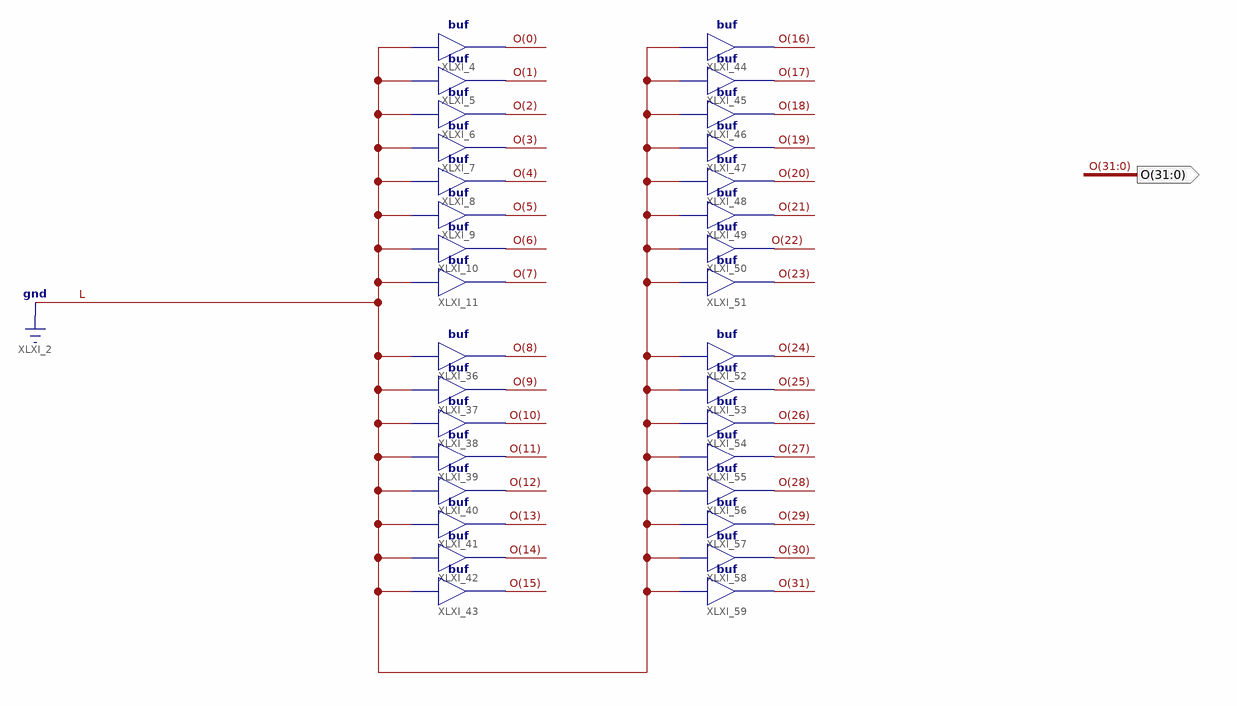
[diagram p0: schematic sheet 1]
// Xilinx ISE schematic DATA0_32.sch (spartan3e) as structural Verilog: 32 symbols, 1 ports
module DATA0_32 (
  output [31:0] O
);

  buf XLXI_4 (O[0], 1'b0);
  buf XLXI_5 (O[1], 1'b0);
  buf XLXI_6 (O[2], 1'b0);
  buf XLXI_7 (O[3], 1'b0);
  buf XLXI_8 (O[4], 1'b0);
  buf XLXI_9 (O[5], 1'b0);
  buf XLXI_10 (O[6], 1'b0);
  buf XLXI_11 (O[7], 1'b0);
  buf XLXI_36 (O[8], 1'b0);
  buf XLXI_37 (O[9], 1'b0);
  buf XLXI_38 (O[10], 1'b0);
  buf XLXI_39 (O[11], 1'b0);
  buf XLXI_40 (O[12], 1'b0);
  buf XLXI_41 (O[13], 1'b0);
  buf XLXI_42 (O[14], 1'b0);
  buf XLXI_43 (O[15], 1'b0);
  buf XLXI_44 (O[16], 1'b0);
  buf XLXI_45 (O[17], 1'b0);
  buf XLXI_46 (O[18], 1'b0);
  buf XLXI_47 (O[19], 1'b0);
  buf XLXI_48 (O[20], 1'b0);
  buf XLXI_49 (O[21], 1'b0);
  buf XLXI_50 (O[22], 1'b0);
  buf XLXI_51 (O[23], 1'b0);
  buf XLXI_52 (O[24], 1'b0);
  buf XLXI_53 (O[25], 1'b0);
  buf XLXI_54 (O[26], 1'b0);
  buf XLXI_55 (O[27], 1'b0);
  buf XLXI_56 (O[28], 1'b0);
  buf XLXI_57 (O[29], 1'b0);
  buf XLXI_58 (O[30], 1'b0);
  buf XLXI_59 (O[31], 1'b0);
endmodule
